# EAGLE design esp-12 (EAGLE 7.3.0)
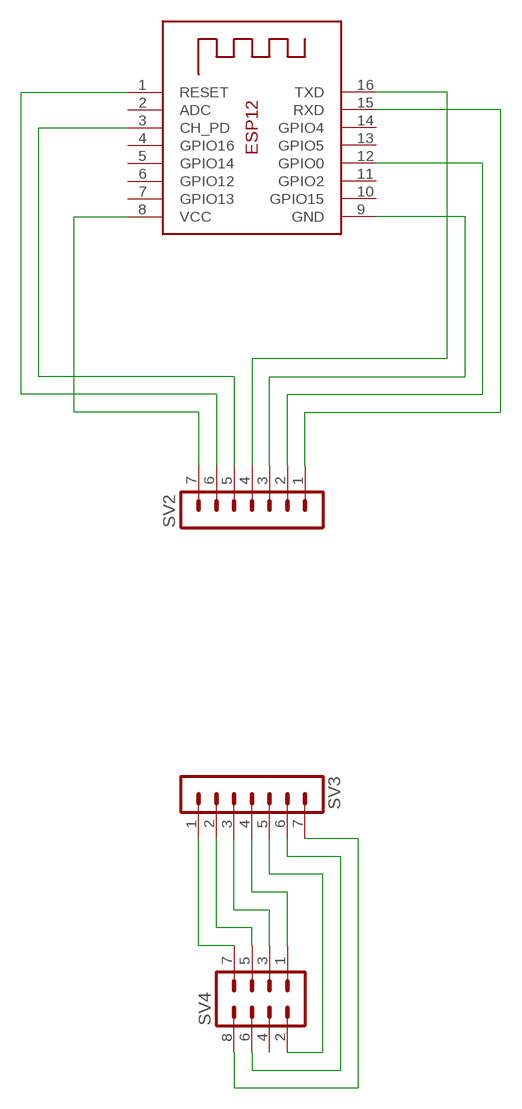
[diagram p0: schematic, sheet 1]

## Parts
SV2  MA07-1  [MA07-1]
SV3  MA07-1  [MA07-1]
SV4  MA04-2  [MA04-2]
X1  ESP-12  [ESP-12]

## Nets
N$1: SV2.7 X1.8(VCC)
N$2: SV2.3 X1.9(GND)
N$3: SV2.5 X1.3(CH_PD)
N$4: SV2.6 X1.1(RESET)
N$5: SV2.4 X1.16(TXD)
N$6: SV2.1 X1.15(RXD)
N$7: SV2.2 X1.12(GPIO0)
N$8: SV3.1 SV4.7
N$9: SV3.2 SV4.5
N$10: SV3.3 SV4.3
N$11: SV3.4 SV4.1
N$12: SV3.5 SV4.2
N$13: SV3.6 SV4.6
N$14: SV3.7 SV4.8
Unconnected: SV4.4 X1.2(ADC) X1.4(GPIO16) X1.5(GPIO14) X1.6(GPIO12) X1.7(GPIO13) X1.10(GPIO15) X1.11(GPIO2) X1.13(GPIO5) X1.14(GPIO4)

## Library data of the parts
SV2 SV3 = con-lstb:MA07-1: PIN HEADER; OC_FARNELL: unknown; OC_NEWARK: unknown
SV4 = con-lstb:MA04-2: PIN HEADER; OC_FARNELL: unknown; OC_NEWARK: unknown
X1 = adafruit:ESP-12

## Board
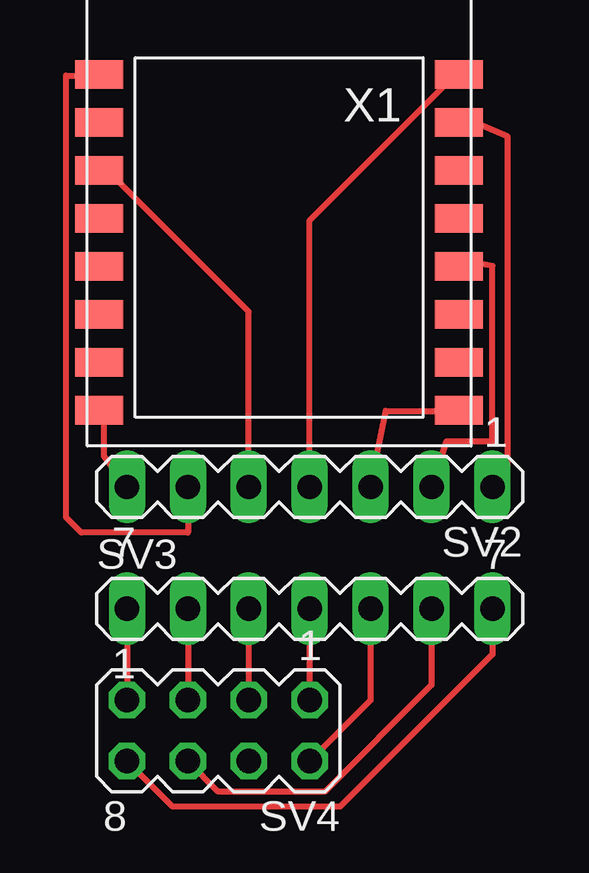
[diagram p1: board, top side]

No outline drawn. Coordinates in mm, seen from the top.
Copper layers (1*16): Top 0.035mm / dielectric 1.5mm / Bottom 0.035mm
Design rules "default": minimum track width 10mil, minimum drill 24mil, track to track 8mil, track to pad 8mil, pad to pad 8mil, via to via 8mil, smd to smd 8mil, copper to edge 40mil, drill to drill 8mil, minimum pad ring 10mil, minimum via ring 8mil, stop-mask expansion 4mil, vias tented up to drill 0mil, thermal gap 10mil

### Footprints (pad centres in the part's own frame; a part is rotated, then mirrored left to right if it is on the bottom)
MA07-1 = drill 1.016 long: 1 -7.62,0; 2 -5.08,0; 3 -2.54,0; 4 0,0; 5 2.54,0; 6 5.08,0; 7 7.62,0
MA04-2 = drill 1.016 octagon: 1 -3.81,-1.27; 2 -3.81,1.27; 3 -1.27,-1.27; 4 -1.27,1.27; 5 1.27,-1.27; 6 1.27,1.27; 7 3.81,-1.27; 8 3.81,1.27
ESP-12 = smd 2 x 1.2: 1 -7.5,4.5; 2 -7.5,2.5; 3 -7.5,0.5; 4 -7.5,-1.5; 5 -7.5,-3.5; 6 -7.5,-5.5; 7 -7.5,-7.5; 8 -7.5,-9.5; 9 7.5,-9.5; 10 7.5,-7.5; 11 7.5,-5.5; 12 7.5,-3.5; 13 7.5,-1.5; 14 7.5,0.5; 15 7.5,2.5; 16 7.5,4.5

### Placement (x,y rotation side)
SV2  17.78,45.72 180 top
SV3  17.78,40.64 0 top
SV4  13.97,35.56 180 top
X1  16.51,58.42 0 top

### Tracks (layer width: path | path; a pad name or v marks a point on that pad's centre or on a via)
N$1
  Top 0.254: SV2.7 9.21,46.99 9.21,48.9 X1.8
N$2
  Top 0.254: SV2.3 20.95,48.9 23.81,48.9 X1.9
N$3
  Top 0.254: SV2.5 15.24,53.02 8.89,59.37 8.57,59.37 9.21,58.74 X1.3
N$4
  Top 0.254: SV2.6 12.7,43.81 8.26,43.81 7.62,44.45 7.62,62.87 8.89,62.87 X1.1
N$5
  Top 0.254: SV2.4 17.78,56.83 23.81,62.87 X1.16
N$6
  Top 0.254: SV2.1 26.04,45.72 26.04,60.33 23.81,61.28 23.5,61.28 24.13,60.64 X1.15
N$7
  Top 0.254: SV2.2 23.5,47.62 25.4,47.62 25.4,54.93 23.81,55.24 24.77,55.24 24.13,54.61 X1.12
N$8
  Top 0.254: SV3.1 SV4.7
N$9
  Top 0.254: SV3.2 SV4.5
N$10
  Top 0.254: SV3.3 SV4.3
N$11
  Top 0.254: SV3.4 SV4.1
N$12
  Top 0.254: SV4.2 20.32,36.83 SV3.5
N$13
  Top 0.254: SV4.6 13.97,33.02 18.41,33.02 22.86,37.47 SV3.6
N$14
  Top 0.254: SV4.8 12.06,32.38 19.05,32.38 25.4,38.73 SV3.7